# Altium schematic sheet Transformer FrontEnd 3.SchDoc
size A4
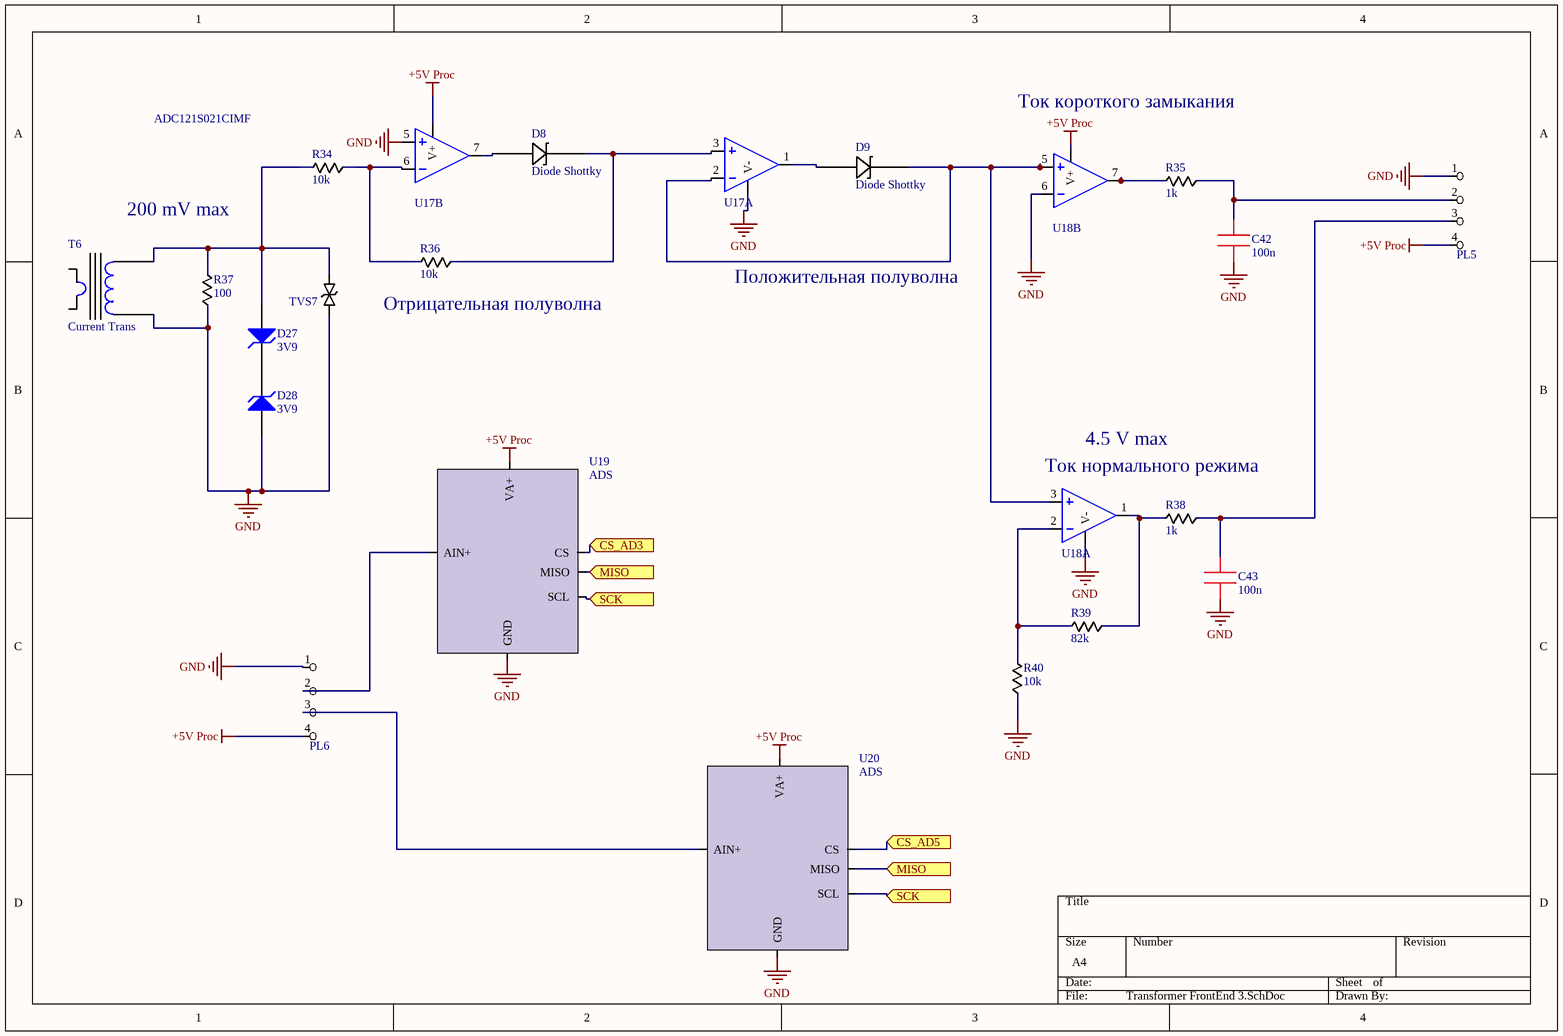
[diagram p0: Transformer FrontEnd 3.SchDoc]

## Parts
C42  100n  [0603]
C43  100n  [0603]
D8  Diode Shottky  [SOD523]
D9  Diode Shottky  [SOD523]
D27  3V9  [SOD80C]
D28  3V9  [SOD80C]
PL5  plug  [PLS 4]  (value not drawn)
PL6  plug  [PLS 4]  (value not drawn)
R34  10k  [0603]
R35  1k  [0603]
R36  10k  [0603]
R37  100  [1206]
R38  1k  [0603]
R39  82k  [0603]
R40  10k  [0603]
T6  Current Trans  [Talema]
TVS7  SMAJ5.0CA  [DO-214AC]  (value not drawn)
U17  OPAMP 2Ch  [SOIC 8]  (value not drawn)  (parts A,B of 2)
U18  OPAMP 2Ch  [SOIC 8]  (value not drawn)  (parts A,B of 2)
U19  ADS  [SOT23 - 6]
U20  ADS  [SOT23 - 6]

## Ports
CS_AD3, CS_AD5, MISO, SCK

## Nets
+5V Proc: PL5.4 PL6.4 U17.8(V+) U18.8(V+) U19.1(VA+) U20.1(VA+)
GND: C42.1 C43.1 D28.1(A) PL5.1 PL6.1 R37.1 R40.1 T6.2 TVS7.1 U17.4(V-) U17.5(+IN) U18.4(V-) U18.6(-IN) U19.2(GND) U20.2(GND)
CS_AD3: U19.6(CS) ; port CS_AD3
CS_AD5: U20.6(CS) ; port CS_AD5
MISO: U19.5(MISO) U20.5(MISO) ; port MISO
SCK: U19.4(SCL) U20.4(SCL) ; port SCK
NetC42_2: C42.2 PL5.2 R35.1
NetC43_2: C43.2 PL5.3 R38.1
NetD8_1: D8.1 U17.7(OUT)
NetD8_2: D8.2 R36.1 U17.3(+IN)
NetD9_1: D9.1 U17.1(OUT)
NetD9_2: D9.2 U17.2(-IN) U18.3(+IN) U18.5(+IN)
NetD27_1: D27.1(A) R34.2 R37.2 T6.1 TVS7.2
NetD27_2: D27.2(K) D28.2(K)
NetPL6_2: PL6.2 U19.3(AIN+)
NetPL6_3: PL6.3 U20.3(AIN+)
NetR34_1: R34.1 R36.2 U17.6(-IN)
NetR35_2: R35.2 U18.7(OUT)
NetR38_2: R38.2 R39.1 U18.1(OUT)
NetR39_2: R39.2 R40.2 U18.2(-IN)

## Notes on the sheet
- Ток короткого замыкания
- ADC121S021CIMF
- 200 mV max
- (near R36) Отрицательная полуволна
- Положительная полуволна
- 4.5 V max
- Ток нормального режима

## Library data of the parts
C42 C43 = 0603 CAP: CC0603KRX7R9BB104
D8 D9 = Diode Shottky: RB751S40T1G
D27 D28 = D Zener: BZV55-C3V9,115
PL5 PL6 = PLS-4R: PLS-4R (DS1022-1x4R)
R34 R36 R40 = 0603 RES: RT0603FRE0710KL
R35 R38 = 0603 RES: RC0603FR-071KL
R37 = SMD Resistor: RT1206BRD07100RL
R39 = 0603 RES: ERJ3EKF8202V
T6 = Current Trans: AC-1005
U17 U18 = OPAMP 2Ch: TS272IDT
U19 U20 = ADS: ADC121S021CIMF